# EAGLE design AST1033 (EAGLE 6.3)
DATABASE: ./../../../../../Components/TinyCircuits_Part_Database.txt
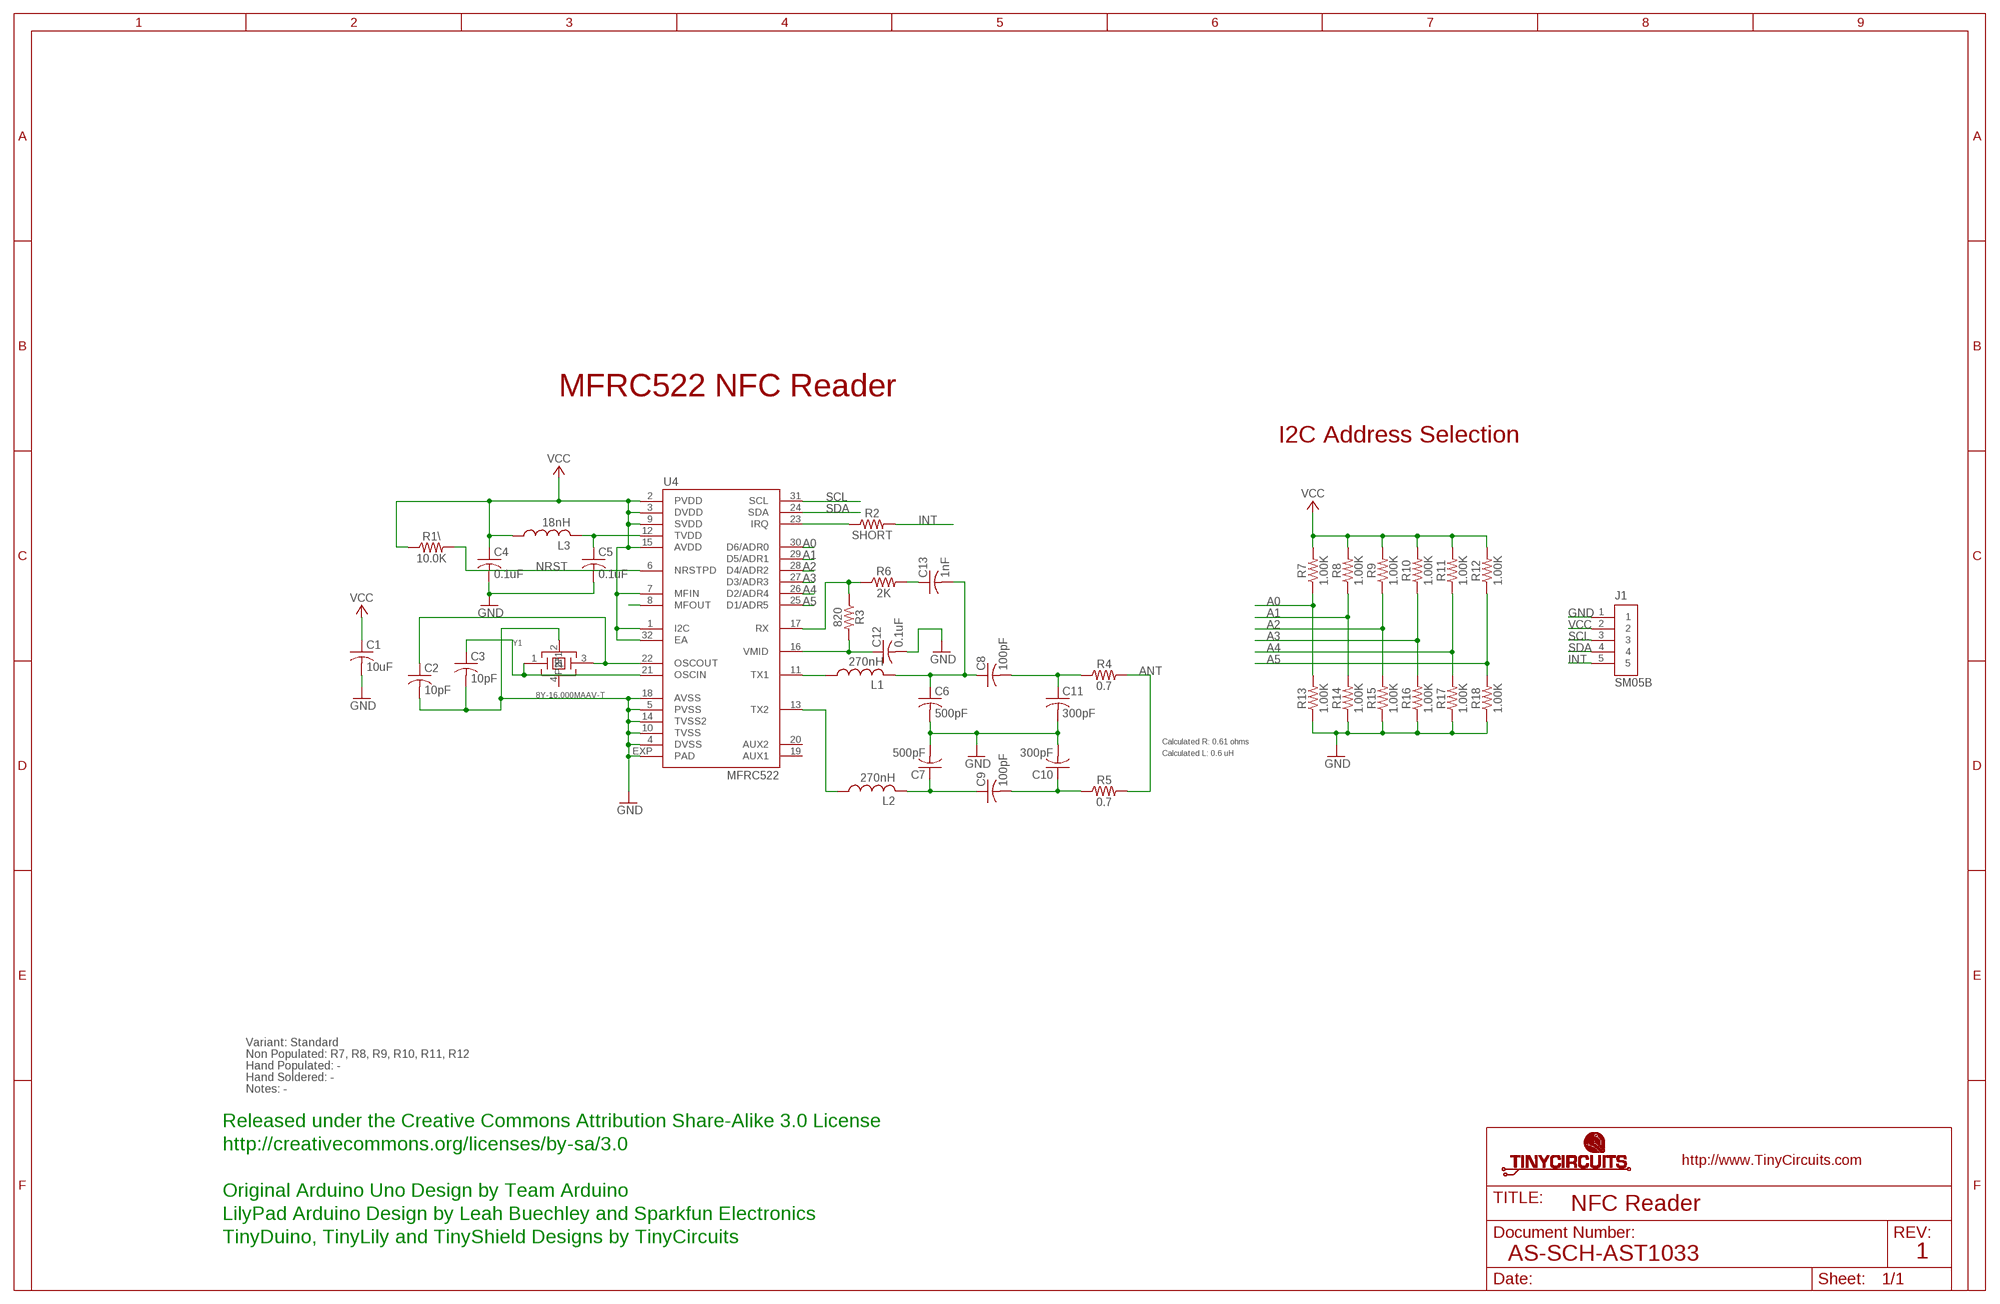
[diagram p0: schematic, sheet 1]

## Parts
C1  10uF  AS-ITM-00002  [C0603]
C2  10pF  AS-ITM-00261  [C0402]
C3  10pF  AS-ITM-00261  [C0402]
C4  0.1uF  AS-ITM-00008  [C0402]
C5  0.1uF  AS-ITM-00008  [C0402]
C6  500pF  AS-ITM-00148  [0402]
C7  500pF  AS-ITM-00148  [0402]
C8  100pF  AS-ITM-00148  [0402]
C9  100pF  AS-ITM-00148  [0402]
C10  300pF  AS-ITM-00008  [C0402]
C11  300pF  AS-ITM-00008  [C0402]
C12  0.1uF  AS-ITM-00008  [C0402]
C13  1nF  AS-ITM-00008  [C0402]
J1  SM05B  AS-ITM-00340  [JST_SH_5X1]
L1  270nH  AS-ITM-00250  [C0402]
L2  270nH  AS-ITM-00250  [C0402]
L3  18nH  AS-ITM-00260  [C0402]
R1\  10.0K  AS-ITM-00032  [0402]
R2  SHORT  AS-ITM-000760402_SHORT  [0402_SHORT]
R3  820  AS-ITM-00076  [0402]
R4  0.7  AS-ITM-00076  [0402]
R5  0.7  AS-ITM-00076  [0402]
R6  2K  AS-ITM-00315  [0402]
R7  1.00K  AS-ITM-00003  [0402]
R8  1.00K  AS-ITM-00003  [0402]
R9  1.00K  AS-ITM-00003  [0402]
R10  1.00K  AS-ITM-00003  [0402]
R11  1.00K  AS-ITM-00003  [0402]
R12  1.00K  AS-ITM-00003  [0402]
R13  1.00K  AS-ITM-00003  [0402]
R14  1.00K  AS-ITM-00003  [0402]
R15  1.00K  AS-ITM-00003  [0402]
R16  1.00K  AS-ITM-00003  [0402]
R17  1.00K  AS-ITM-00003  [0402]
R18  1.00K  AS-ITM-00003  [0402]
U4  MFRC522  AS-ITM-00293  [ATMEL_QFN32]
Y1  8Y-16.000MAAV-T  AS-ITM-00228  [ABM11]

## Nets
A0: R7.1 R13.2 U4.30(D6/ADR0)
A1: R8.1 R14.2 U4.29(D5/ADR1)
A2: R9.1 R15.2 U4.28(D4/ADR2)
A3: R10.1 R16.2 U4.27(D3/ADR3)
A4: R11.1 R17.2 U4.26(D2/ADR4)
A5: R12.1 R18.2 U4.25(D1/ADR5)
ANT: R4.2 R5.2
GND: C1.2 C2.2 C3.2 C4.2 C5.2 C6.2 C7.2 C10.2 C11.2 C12.2 J1.1 R13.1 R14.1 R15.1 R16.1 R17.1 R18.1 U4.4(DVSS) U4.5(PVSS) U4.10(TVSS) U4.14(TVSS2) U4.18(AVSS) U4.EXP(PAD) Y1.2
INT: J1.5 R2.2
N$1: R2.1 U4.23(IRQ)
N$2: L1.1 U4.11(TX1)
N$3: L2.1 U4.13(TX2)
N$4: C6.1 C8.1 C13.2 L1.2
N$5: U4.8(MFOUT)
N$16: R3.1 R6.1 U4.17(RX)
N$17: C7.1 C9.1 L2.2
N$18: C2.1 U4.22(OSCOUT) Y1.3
N$19: C3.1 U4.21(OSCIN) Y1.1
N$20: C9.2 C10.1 R5.1
N$22: C12.1 R3.2 U4.16(VMID)
N$23: C8.2 C11.1 R4.1
N$24: C5.1 L3.2 U4.12(TVDD)
N$25: C13.1 R6.2
NRST: R1\.2 U4.6(NRSTPD)
SCL: J1.3 U4.31(SCL)
SDA: J1.4 U4.24(SDA)
VCC: C1.1 C4.1 J1.2 L3.1 R1\.1 R7.2 R8.2 R9.2 R10.2 R11.2 R12.2 U4.1(I2C) U4.2(PVDD) U4.3(DVDD) U4.7(MFIN) U4.9(SVDD) U4.15(AVDD) U4.32(EA)
Unconnected: U4.19(AUX1) U4.20(AUX2) Y1.4(P1)

## Notes on the sheet
- MFRC522 NFC Reader
- I2C Address Selection
- Calculated R: 0.61 ohms
- Calculated L: 0.6 uH
- Variant: Standard
- Non Populated: R7, R8, R9, R10, R11, R12
- Hand Populated: -
- Hand Soldered: -
- Notes: -
- Released under the Creative Commons Attribution Share-Alike 3.0 License
- http://creativecommons.org/licenses/by-sa/3.0
- Original Arduino Uno Design by Team Arduino
- NFC Reader
- LilyPad Arduino Design by Leah Buechley and Sparkfun Electronics
- TinyDuino, TinyLily and TinyShield Designs by TinyCircuits
- AS-SCH-AST1033 | 1

## Library data of the parts
C1 = tinycircuits:AS-ITM-00002: CAP CER 10UF 10V 20% X5R 0603; PARTNO: AS-ITM-00002
C2 C3 = tinycircuits:AS-ITM-00261: CAP CER 12PF 50V 1% NP0 0402; PARTNO: AS-ITM-00261; VALUE: 12pF
C4 C5 C12 = tinycircuits:AS-ITM-00008: CAP CER 0.1UF 16V 10% X5R 0402; PARTNO: AS-ITM-00008
C6 C7 = tinycircuits:AS-ITM-00148: CAP CER 100PF 50V 5% NPO 0402; PARTNO: AS-ITM-00148; VALUE: 100pF
C8 C9 = tinycircuits:AS-ITM-00148: CAP CER 100PF 50V 5% NPO 0402; PARTNO: AS-ITM-00148
C10 C11 C13 = tinycircuits:AS-ITM-00008: CAP CER 0.1UF 16V 10% X5R 0402; PARTNO: AS-ITM-00008; VALUE: 0.1uF
J1 = tinycircuits:AS-ITM-00340: CONN HEADER SH 5POS SIDE 1MM TIN; PARTNO: AS-ITM-00340; PNPROTATION: 180
L1 L2 = tinycircuits:AS-ITM-00250: FIXED IND 270NH 200MA 4.8 OHM; PARTNO: AS-ITM-00250
L3 = tinycircuits:AS-ITM-00260: FIXED IND 18NH 240MA 700 MOHM; PARTNO: AS-ITM-00260
R1\ = tinycircuits:AS-ITM-00032: RES 10.0K OHM 1/16W 1% 0402 SMD; PARTNO: AS-ITM-00032
R2 = tinycircuits:AS-ITM-00076: RES 0.0 OHM 1/16W 1% 0402 SMD; PARTNO: AS-ITM-00076
R3-R5 = tinycircuits:AS-ITM-00076: RES 0.0 OHM 1/16W 1% 0402 SMD; PARTNO: AS-ITM-00076; VALUE: 0.0
R6 = tinycircuits:AS-ITM-00315: RES SMD 2K OHM 1% 1/16W 0402; PARTNO: AS-ITM-00315
R7-R18 = tinycircuits:AS-ITM-00003: RES 1.00K OHM 1/16W 1% 0402; PARTNO: AS-ITM-00003
U4 = tinycircuits:AS-ITM-00293: IC NFC READER 32-HVQFN; PARTNO: AS-ITM-00293
Y1 = tinycircuits:AS-ITM-00228: CRYSTAL 16MHZ 8PF SMD; PARTNO: AS-ITM-00228; PNPROTATION: 0

## Net classes
2 gnd: width 0.305 mm, drill 0.559 mm, clearance 0.254 mm

## Board
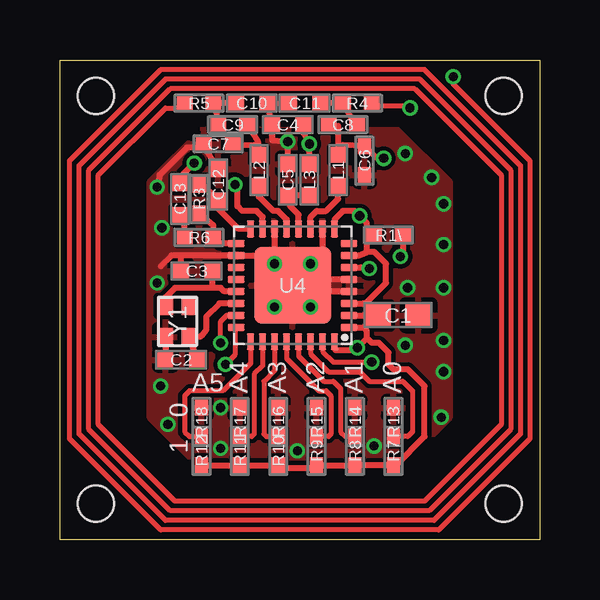
[diagram p1: board, top side]
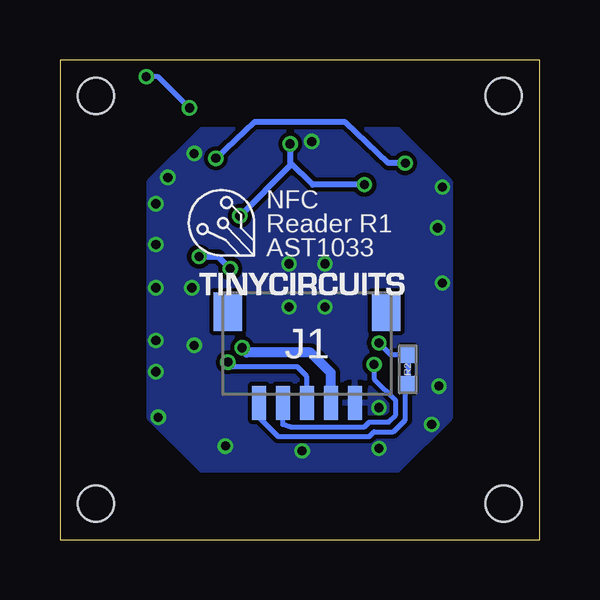
[diagram p2: board, bottom side, seen from below]

Size 20 x 20 mm. Coordinates in mm from the lower left corner, seen from the top.
Outline: 0,20 20,20 20,0 0,0 0,20
Copper layers (1*16): Top 0.035mm / dielectric 1.5mm / Bottom 0.035mm
Design rules "default *": minimum track width 8mil, minimum drill 15mil, track to track 7mil, track to pad 7mil, pad to pad 7mil, via to via 7mil, smd to smd 7mil, copper to edge 8mil, drill to drill 8mil, minimum pad ring 8mil, minimum via ring 5mil, stop-mask expansion 4mil, vias tented up to drill 25mil, thermal gap 10mil
Holes 1.5 mm at 1.5,18.5 18.5,18.5 18.5,1.5 1.5,1.5
tRestrict: 1 lines

### Footprints (pad centres in the part's own frame; a part is rotated, then mirrored left to right if it is on the bottom)
C0603 = smd 1.1 x 1: 1 -0.85,0; 2 0.85,0
C0402 = smd 0.65 x 0.6: 1 -0.65,0; 2 0.65,0
0402 = smd 0.65 x 0.55: 1 -0.6,0; 2 0.6,0
JST_SH_5X1 = smd 0.6 x 1.4: 1 -2,2.475; 2 -1,2.475; 3 0,2.475; 4 1,2.475; 5 2,2.475 | smd 1.2 x 1.6: PAD1 -3.3,-1.325; PAD2 3.3,-1.325
0402_SHORT = smd 0.65 x 0.55: 1 -0.6,0; 2 0.6,0
ATMEL_QFN32 = smd 0.711 x 0.305: 1 -2.351,1.75; 2 -2.351,1.25; 3 -2.351,0.75; 4 -2.351,0.25; 5 -2.351,-0.25; 6 -2.351,-0.75; 7 -2.351,-1.25; 8 -2.351,-1.75; 17 2.351,-1.75; 18 2.351,-1.25; 19 2.351,-0.75; 20 2.351,-0.25; 21 2.351,0.25; 22 2.351,0.75; 23 2.351,1.25; 24 2.351,1.75 | smd 0.305 x 0.711: 9 -1.75,-2.351; 10 -1.25,-2.351; 11 -0.75,-2.351; 12 -0.25,-2.351; 13 0.25,-2.351; 14 0.75,-2.351; 15 1.25,-2.351; 16 1.75,-2.351; 25 1.75,2.351; 26 1.25,2.351; 27 0.75,2.351; 28 0.25,2.351; 29 -0.25,2.351; 30 -0.75,2.351; 31 -1.25,2.351; 32 -1.75,2.351 | smd 3.2 x 3.2: EXP 0,0
ABM11 = smd 0.75 x 0.65: 1 -0.65,-0.5; 2 0.65,-0.5; 3 0.65,0.5; 4 -0.65,0.5

### Placement (x,y rotation side)
C1  14.1,9.35 0 top
C2  5.05,7.5 180 top
C3  5.7,11.2 180 top
C4  9.5,17.3 180 top
C5  9.5,15 90 top
C6  12.7,15.8 270 top
C7  6.6,16.5 180 top
C8  11.8,17.3 0 top
C9  7.2,17.3 180 top
C10  8,18.2 0 top
C11  10.2,18.2 180 top
C12  6.6,14.8 90 top
C13  5,14.2 90 top
J1  9.7,8.18 180 bottom
L1  11.6,15.4 90 top
L2  8.3,15.4 90 top
L3  10.4,15 270 top
R1\  13.7,12.7 0 top
R2  5.5,7.1 270 bottom
R3  5.8,14.2 90 top
R4  12.4,18.2 0 top
R5  5.8,18.2 180 top
R6  5.8,12.6 180 top
R7  13.9,3.7 270 top
R8  12.3,3.7 270 top
R9  10.7,3.7 270 top
R10  9.1,3.7 270 top
R11  7.5,3.7 270 top
R12  5.9,3.7 270 top
R13  13.9,4.9 270 top
R14  12.3,4.9 270 top
R15  10.7,4.9 270 top
R16  9.1,4.9 270 top
R17  7.5,4.9 270 top
R18  5.9,4.9 270 top
U4  9.7,10.6 180 top
U$1  [DOCFIELD-TINYCIRCUITS-PCB]  29,-10 0 top  (outside the outline)
Y1  4.9,9.1 270 top

### Tracks (layer width: path | path; a pad name or v marks a point on that pad's centre or on a via)
A0
  Top 0.203: U4.30 10.45,7.75 11.2,7 12.5,7 12.9,6.6 14.3,6.6 14.7,6.2 14.7,4.5 14.5,4.3 R13.2
A1
  Top 0.203: U4.29 9.95,7.65 11,6.6 11.4,6.6 11.7,6.3 11.7,4.5 11.9,4.3 R14.2
A2
  Top 0.203: U4.28 9.45,7.55 10.8,6.2 11.1,6.2 11.3,6 11.3,4.4 11.2,4.3 R15.2
A3
  Top 0.203: U4.27 8.95,7.05 8.5,6.6 8.5,4.4 8.6,4.3 R16.2
A4
  Top 0.203: U4.26 8.45,7.25 8.1,6.9 8.1,4.4 8,4.3 R17.2
A5
  Top 0.203: U4.25 7.95,7.35 6.8,6.2 5.4,6.2 5.2,6 5.2,4.5 5.4,4.3 R18.2
ANT  (via drill 0.38)
  Top 0.203: R5.2 4.9,18 4.4,18 1.6,15.2 1.6,4.8 4.8,1.6 15.2,1.6 18.4,4.8 18.4,15.2 14.8,18.8 4.6,18.8 1.2,15.4 1.2,4.6 4.6,1.2 15.4,1.2 18.8,4.6 18.8,15.4 15,19.2 4.4,19.2 0.8,15.6 0.8,4.4 4.4,0.8 15.6,0.8 19.2,4.4 19.2,15.6 15.2,19.6 4.2,19.6 0.4,15.8 0.4,4.2 4.2,0.4 15.8,0.4 19.6,4.2 19.6,15.8 16.4,19 v16.4,19.3 | R4.2 13.1,18.1 14.5,18.1 v14.6,18
  Bottom 0.203: v14.6,18 15.9,19.3 v16.4,19.3
GND  (via drill 0.38)
  Top 0.254: C5.2 v9.5,16.6 8.85,16.65 C4.2 C10.2 C11.2 | U4.4 10.2,10.35 | 10.2,10.35 9.95,10.35 U4.EXP | U4.5 9.95,10.85 U4.EXP | U4.14 8.95,11.35 U4.EXP | U4.EXP 8.45,11.85 U4.18 5,11.85 | U4.10 10.95,11.1 10.2,10.35 | 5,11.85 4.65,11.85 4.2,11.4 | C3.2 5.05,11.8 5,11.85 | Y1.2 C2.2 | C12.2 6.05,16.35 | 6.05,16.35 C7.2 | 6.05,16.35 5.3,16.35 4.15,15.2 v4.05,14.7
  other vias: 15.5,15.1 14.4,16.1 14.5,10.5 8.95,9.7 10.45,9.7 10.45,11.5 8.95,11.5 4.25,13 4.05,10.7 4.2,6.4 13.1,3.9 15.9,5.1 9.9,3.7 6.7,3.8 6.7,5.5 4.5,4.8 16,7 16,8.3 16,10.5 16,12.3 16,14 14.4,8.1
  pour Top: 5.9,2.9 14.1,2.9 16.3,5.1 16.3,14.9 14.1,17.1 5.9,17.1 3.7,14.9 3.7,5.1
  pour Bottom: 5.9,17.1 14.1,17.1 16.3,14.9 16.3,5.1 14.1,2.9 5.9,2.9 3.7,5.1 3.7,14.9
INT
  Bottom 0.203: J1.5 11.7,5.1 10.9,4.3 7.1,4.3 6.9,4.5 6.1,4.5 5.6,5 5.6,6.4 R2.2
N$1  (via drill 0.38)
  Top 0.203: v6.7,8.2 6.7,9.1 6.95,9.35 U4.23
  Bottom 0.203: R2.1 6.2,7.7 v6.7,8.2
N$2
  Top 0.254: U4.11 10.45,13.45 10.7,13.7 11.1,13.7 11.6,14.2 L1.1
N$3
  Top 0.254: U4.13 9.45,13.35 9.1,13.7 8.9,13.7 8.3,14.3 L2.1
N$4  (via drill 0.38)
  Top 0.254: C8.1 11.6,17.25 L1.2 11.8,16.45 C6.1 13.3,15.85 v13.5,15.9 | C13.2 5.1,15.2 v5.6,15.7
  Bottom 0.254: v5.6,15.7 6.3,15.7 8.1,17.4 11.9,17.4 v13.5,15.9
N$16
  Top 0.254: U4.17 6.65,12.35 R6.1 6.4,13.1 R3.1
N$17
  Top 0.254: C7.1 8.1,16.45 L2.2 8.25,16.6 C9.1
N$18
  Top 0.254: U4.22 6.65,9.85 6.1,9.3 6.1,8.75 5.9,8.5 5.85,8.45 Y1.3 5.5,8.15 C2.1
N$19
  Top 0.254: U4.21 6.85,10.35 6.7,10.5 6.4,10.5 | 6.4,10.5 4.8,10.5 4.4,10.1 Y1.1 | C3.1 6.35,10.55 6.4,10.5
N$20
  Top 0.254: C9.2 6.5,18.05 R5.1 C10.1
N$22
  Top 0.254: U4.16 7.45,12.95 6.6,13.8 C12.1 5.95,14.8 R3.2
N$23
  Top 0.254: C8.2 12.3,17.35 R4.1 C11.1
N$24
  Top 0.254: L3.2 C5.1 9.6,14.35 9.6,13.9 9.95,13.55 U4.12
N$25
  Top 0.254: R6.2 5.2,13.45 C13.1
NRST  (via drill 0.38)
  Top 0.254: U4.6 12.55,11.35 v12.9,11.3 | R1\.2 14.3,11.9 v14.2,11.8
  Bottom 0.254: v14.2,11.8 13.4,11.8 v12.9,11.3
SCL  (via drill 0.38)
  Top 0.203: U4.31 10.95,7.85 11.4,7.4 v13,7.4
  Bottom 0.203: J1.3 9.7,6.8 10.1,7.2 13,7.2 v13,7.4
SDA  (via drill 0.38)
  Top 0.203: 7.3,8.8 7.3,7.7 v6.9,7.3
  Top 0.254: 7.3,8.8 U4.24
  Bottom 0.203: v6.9,7.3 6.9,6.7 6,5.8 6,5.2 6.3,4.9 7.1,4.9 7.3,4.7 10.4,4.7 10.7,4.8 J1.4
VCC  (via drill 0.38)
  Top 0.254: 12.8,9.5 12.65,9.35 U4.2 | 12.8,9.5 12.8,9.7 | 12.8,12.9 12.8,13.2 v12.5,13.5 12.3,13.7 11.8,13.7 11.45,13.35 U4.9 | 12.8,9.7 12.65,9.85 U4.3 | U4.7 12.45,11.85 12.8,12 | U4.1 12.65,8.85 | 12.65,8.85 12.8,9 12.8,9.5 | C4.1 10.15,16.95 v10.4,16.5 L3.1 | U4.15 8.45,13.45 8.2,13.7 7.6,13.7 7.4,13.9 7.4,14.7 v7.3,14.8 | U4.32 11.45,7.95 11.5,7.9 12.3,7.9 v12.4,8 12.8,8.4 | 12.8,8.4 12.8,8.7 12.65,8.85 | 12.8,12 12.8,12.7 | 12.8,12.7 12.8,12.9 | 12.8,12.9 12.85,12.85 | 12.8,9.7 12.8,9.9 13.6,10.7 13.6,11.5 13.11,12 12.8,12 | R1\.1 12.8,12.7 | C1.1 13.1,9.5 12.8,9.5 | R12.2 R11.2 R10.2 9.2,3 10.6,3 R9.2 R8.2 R7.2 14,3.1 15.2,4.3 15.2,6.4 14.5,7.1 13.9,7.1 13.7,7.3 13.7,7.8 13.3,8.2 13,8.2 12.8,8.4
  Bottom 0.254: v10.4,16.5 10.4,15.75 | 10.4,15.75 10.4,15.6 v12.5,13.5 | v7.3,14.8 9.45,14.8 10.4,15.75
  Bottom 0.406: J1.2 8.7,6.95 9.55,7.8 12.2,7.8 v12.4,8

### Text on the board
tPlace: A5 | A4 | A3 | A2 | A1 | A0 | 0 | 1
bPlace: NFC | Reader R1 | AST1033
Document: FABRICATION DRAWING | NOTES: | 1. PRINTED CIRCUIT BOARD MADE FROM NEMA GRADE FR-4 EPOXY LAMINATE | WITH 1 OUNCE COPPER PLATING AND .024 THICKNESS. | 2. ALL DIMENSIONS ARE GIVEN IN MILLIMETERS. | 3. CIRCUIT PATHS ARE FOR REFERENCE ONLY. | 4. HOLE SIZES SHOWN ARE FINISHED DIAMETERS AFTER PLATING. | 5. BOARD PLATED USING REFLOW OR SIMILAR METHOD. | 6. BOARD TO HAVE BLUE SOLDER MASK ON PLATED SURFACES USING WET FILM | 7. SILKSCREEN BOARD USING WHITE INK. | SR100 OR SR1010 EPOXY. EQUIVALENT WET OR DRY FILM MAY BE USED. | 8. THE FOLLOWING INFORMATION APPLIES TO THIS BOARD: | * 2 COPPER LAYERS | * .024 BOARD THICKNESS | * REQUIRES TOP SIDE SILKSCREEN | Released under the Creative Commons Attribution Share-Alike 3.0 License | http://creativecommons.org/licenses/by-sa/3.0 | Original Arduino Uno Design by Team Arduino | LilyPad Arduino Design by Leah Buechley and Sparkfun Electronics | TinyDuino, TinyLily and TinyShield Designs by TinyCircuits | NFC Reader | AS-PCB-AST1033 | 1